# Altium schematic sheet Inverter.SchDoc: S88-N Occupancy Detector
size A4; DrawnBy: Sem Kirkels; DocumentNumber: 23P001S03; Revision: V2; SheetNumber: 3; SheetTotal: 6
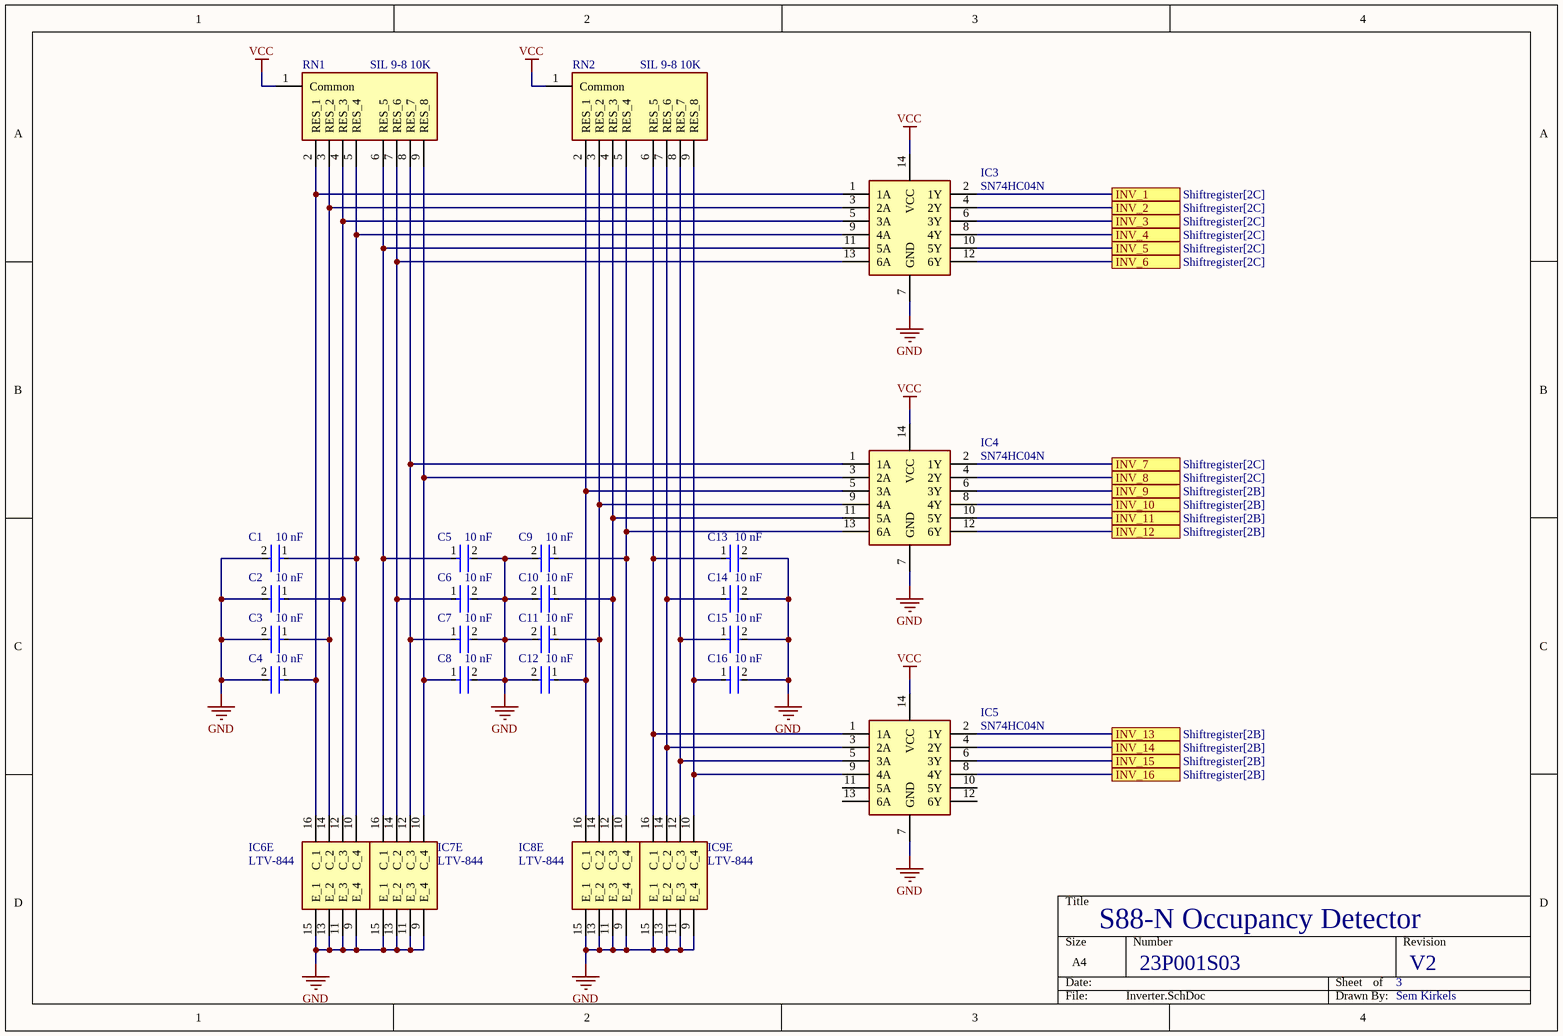
[diagram p0: Inverter.SchDoc]

## Parts
C1  10 nF  [Capacitor]
C2  10 nF  [Capacitor]
C3  10 nF  [Capacitor]
C4  10 nF  [Capacitor]
C5  10 nF  [Capacitor]
C6  10 nF  [Capacitor]
C7  10 nF  [Capacitor]
C8  10 nF  [Capacitor]
C9  10 nF  [Capacitor]
C10  10 nF  [Capacitor]
C11  10 nF  [Capacitor]
C12  10 nF  [Capacitor]
C13  10 nF  [Capacitor]
C14  10 nF  [Capacitor]
C15  10 nF  [Capacitor]
C16  10 nF  [Capacitor]
IC3  SN74HC04N  [SN74HC04]
IC4  SN74HC04N  [SN74HC04]
IC5  SN74HC04N  [SN74HC04]
IC6  LTV-844  [CD4014]  (part E of 5)
IC7  LTV-844  [CD4014]  (part E of 5)
IC8  LTV-844  [CD4014]  (part E of 5)
IC9  LTV-844  [CD4014]  (part E of 5)
RN1  SIL 9-8 10K  [SIL 9-8 10K]
RN2  SIL 9-8 10K  [SIL 9-8 10K]

## Ports
INV_1 (see Shiftregister[2C]), INV_2 (see Shiftregister[2C]), INV_3 (see Shiftregister[2C]), INV_4 (see Shiftregister[2C]), INV_5 (see Shiftregister[2C]), INV_6 (see Shiftregister[2C]), INV_7 (see Shiftregister[2C]), INV_8 (see Shiftregister[2C]), INV_9 (see Shiftregister[2B]), INV_10 (see Shiftregister[2B]), INV_11 (see Shiftregister[2B]), INV_12 (see Shiftregister[2B]), INV_13 (see Shiftregister[2B]), INV_14 (see Shiftregister[2B]), INV_15 (see Shiftregister[2B]), INV_16 (see Shiftregister[2B])

## Nets
GND: C1.2 C2.2 C3.2 C4.2 C5.2 C6.2 C7.2 C8.2 C9.2 C10.2 C11.2 C12.2 C13.2 C14.2 C15.2 C16.2 IC3.7(GND) IC4.7(GND) IC5.7(GND) IC6.9(E_4) IC6.11(E_3) IC6.13(E_2) IC6.15(E_1) IC7.9(E_4) IC7.11(E_3) IC7.13(E_2) IC7.15(E_1) IC8.9(E_4) IC8.11(E_3) IC8.13(E_2) IC8.15(E_1) IC9.9(E_4) IC9.11(E_3) IC9.13(E_2) IC9.15(E_1)
VCC: IC3.14(VCC) IC4.14(VCC) IC5.14(VCC) RN1.1(Common) RN2.1(Common)
INV_1: IC3.2(1Y) ; port INV_1
INV_2: IC3.4(2Y) ; port INV_2
INV_3: IC3.6(3Y) ; port INV_3
INV_4: IC3.8(4Y) ; port INV_4
INV_5: IC3.10(5Y) ; port INV_5
INV_6: IC3.12(6Y) ; port INV_6
INV_7: IC4.2(1Y) ; port INV_7
INV_8: IC4.4(2Y) ; port INV_8
INV_9: IC4.6(3Y) ; port INV_9
INV_10: IC4.8(4Y) ; port INV_10
INV_11: IC4.10(5Y) ; port INV_11
INV_12: IC4.12(6Y) ; port INV_12
INV_13: IC5.2(1Y) ; port INV_13
INV_14: IC5.4(2Y) ; port INV_14
INV_15: IC5.6(3Y) ; port INV_15
INV_16: IC5.8(4Y) ; port INV_16
NetC1_1: C1.1 IC3.9(4A) IC6.10(C_4) RN1.5(RES_4)
NetC2_1: C2.1 IC3.5(3A) IC6.12(C_3) RN1.4(RES_3)
NetC3_1: C3.1 IC3.3(2A) IC6.14(C_2) RN1.3(RES_2)
NetC4_1: C4.1 IC3.1(1A) IC6.16(C_1) RN1.2(RES_1)
NetC5_1: C5.1 IC3.11(5A) IC7.16(C_1) RN1.6(RES_5)
NetC6_1: C6.1 IC3.13(6A) IC7.14(C_2) RN1.7(RES_6)
NetC7_1: C7.1 IC4.1(1A) IC7.12(C_3) RN1.8(RES_7)
NetC8_1: C8.1 IC4.3(2A) IC7.10(C_4) RN1.9(RES_8)
NetC9_1: C9.1 IC4.13(6A) IC8.10(C_4) RN2.5(RES_4)
NetC10_1: C10.1 IC4.11(5A) IC8.12(C_3) RN2.4(RES_3)
NetC11_1: C11.1 IC4.9(4A) IC8.14(C_2) RN2.3(RES_2)
NetC12_1: C12.1 IC4.5(3A) IC8.16(C_1) RN2.2(RES_1)
NetC13_1: C13.1 IC5.1(1A) IC9.16(C_1) RN2.6(RES_5)
NetC14_1: C14.1 IC5.3(2A) IC9.14(C_2) RN2.7(RES_6)
NetC15_1: C15.1 IC5.5(3A) IC9.12(C_3) RN2.8(RES_7)
NetC16_1: C16.1 IC5.9(4A) IC9.10(C_4) RN2.9(RES_8)

Not connected (* = marked no-connect by the designer): IC5 10(5Y) 11(5A) 12(6Y) 13(6A)

## Library data of the parts
C1-C16 = Capacitor: Voltage Rating (AC): 500V; Lead Diameter: 0.6mm; Capacitance: 4.7nF; Tolerance: 20%; Lead/Base Style: Kinked; Dielectric: Y5U; Termination: Radial; Resistor Type: Ceramic; Radiation Hardening: No; Diameter: 16mm; Max Operating Temperature: 125°C; Case/Package: Radial; Thickness: 5mm; Lead Pitch: 10mm; Series: VY1; Contact Plating: Tin; Depth: 5mm; RoHS Compliant: Yes; Voltage: 500V; Voltage Rating (DC): 500V; Package Quantity: 500; Construction: RADIAL; Min Operating Temperature: -40°C; Height: 19mm; Height - Seated (Max): 0.787inch; Packaging: Tape and Reel; Mount: Through Hole
IC3-IC5 = SN74HC04N: Integrated Circuit; Manufacturer_Name: Texas Instruments; Datasheet Link: http://www.ti.com/lit/gpn/sn74hc04; Height: 5.08mm; Manufacturer_Part_Number: SN74HC04N; Mouser Part Number: 595-SN74HC04N; Mouser Price/Stock: https://www.mouser.co.uk/ProductDetail/Texas-Instruments/SN74HC04N?qs=L5CvrNUdZirrSGYiJvTylA%3D%3D; Arrow Part Number: SN74HC04N; Arrow Price/Stock: https://www.arrow.com/en/products/sn74hc04n/texas-instruments?region=nac
IC6-IC9 = LTV-844: Integrated Circuit; Manufacturer_Name: Lite-On; Datasheet Link: https://componentsearchengine.com/Datasheets/1/LTV-844.pdf; Height: 4.5mm; Manufacturer_Part_Number: LTV-844; Mouser Part Number: 859-LTV-844; Mouser Price/Stock: https://www.mouser.co.uk/ProductDetail/Lite-On/LTV-844?qs=BZ0sscl82p8P4kyBjSwzAg%3D%3D; Arrow Part Number: LTV-844; Arrow Price/Stock: https://www.arrow.com/en/products/ltv-844/lite-on-technology?region=nac
RN1 RN2 = SIL 9-8 10K: CSC09A0110K0GEK; Manufacturer_Name: Vishay; Datasheet Link: https://www.vishay.com/docs/31509/csc.pdf; Height: 4.95mm; Manufacturer_Part_Number: CSC09A0110K0GEK; Mouser Part Number: 71-CSC09A0110K0GEK; Mouser Price/Stock: https://www.mouser.co.uk/ProductDetail/Vishay-Dale/CSC09A0110K0GEK?qs=Jzz%252BfO4IBMfusae2i1IhQQ%3D%3D; Arrow Part Number: CSC09A0110K0GEK; Arrow Price/Stock: https://www.arrow.com/en/products/csc09a0110k0gek/vishay